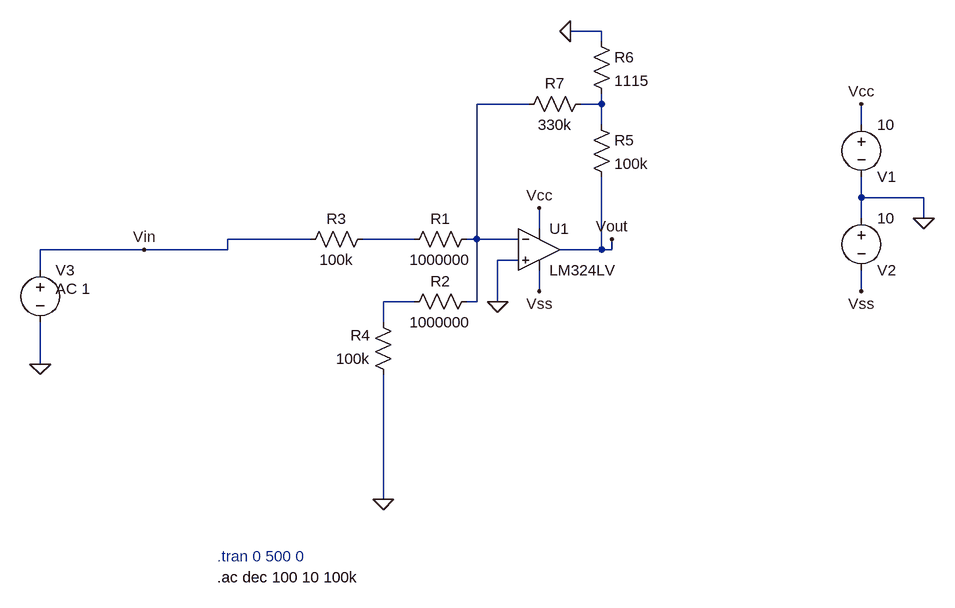
[diagram p0: schematic Sumador (1).asc]
Sumador (1).asc, the LTspice schematic file:
Version 4.1
SHEET 1 888 696
WIRE 304 -160 256 -160
WIRE 304 -144 304 -160
WIRE 192 -48 112 -48
WIRE 304 -48 304 -64
WIRE 304 -48 272 -48
WIRE 304 -16 304 -48
WIRE 704 -16 704 -48
WIRE 704 96 704 64
WIRE 800 96 704 96
WIRE 704 128 704 96
WIRE 800 128 800 96
WIRE 208 144 208 112
WIRE -144 160 -272 160
WIRE 16 160 -64 160
WIRE 112 160 112 -48
WIRE 112 160 96 160
WIRE 176 160 112 160
WIRE -400 176 -560 176
WIRE -272 176 -272 160
WIRE -272 176 -400 176
WIRE 304 176 304 64
WIRE 304 176 240 176
WIRE 320 176 320 160
WIRE 320 176 304 176
WIRE 176 192 144 192
WIRE -560 208 -560 176
WIRE 208 240 208 208
WIRE 704 240 704 208
WIRE 16 256 -32 256
WIRE 112 256 112 160
WIRE 112 256 96 256
WIRE 144 256 144 192
WIRE -32 288 -32 256
WIRE -560 352 -560 288
WIRE -32 560 -32 368
FLAG 144 256 0
FLAG -560 352 0
FLAG -32 560 0
FLAG 800 128 0
FLAG 208 112 Vcc
FLAG 704 -48 Vcc
FLAG 208 240 Vss
FLAG 704 240 Vss
FLAG -400 176 Vin
FLAG 320 160 Vout
FLAG 256 -160 0
SYMBOL res 112 144 R90
WINDOW 0 0 56 VBottom 2
WINDOW 3 32 56 VTop 2
SYMATTR InstName R1
SYMATTR Value 1000000
SYMBOL res 112 240 R90
WINDOW 0 0 56 VBottom 2
WINDOW 3 32 56 VTop 2
SYMATTR InstName R2
SYMATTR Value 1000000
SYMBOL res -48 144 R90
WINDOW 0 0 56 VBottom 2
WINDOW 3 32 56 VTop 2
SYMATTR InstName R3
SYMATTR Value 100k
SYMBOL res -16 384 R180
WINDOW 0 36 76 Left 2
WINDOW 3 36 40 Left 2
SYMATTR InstName R4
SYMATTR Value 100k
SYMBOL voltage 704 -32 R0
WINDOW 0 24 96 Left 2
WINDOW 3 24 16 Left 2
WINDOW 123 0 0 Left 0
WINDOW 39 0 0 Left 0
SYMATTR InstName V1
SYMATTR Value 10
SYMBOL voltage 704 112 R0
WINDOW 0 24 96 Left 2
WINDOW 3 24 16 Left 2
WINDOW 123 0 0 Left 0
WINDOW 39 0 0 Left 0
SYMATTR InstName V2
SYMATTR Value 10
SYMBOL ZZZ\\OpAmp\\LM324LV 208 112 R0
SYMATTR InstName U1
SYMBOL res 288 -32 R0
SYMATTR InstName R5
SYMATTR Value 100k
SYMBOL res 288 -160 R0
SYMATTR InstName R6
SYMATTR Value 1115
SYMBOL res 288 -64 R90
WINDOW 0 0 56 VBottom 2
WINDOW 3 32 56 VTop 2
SYMATTR InstName R7
SYMATTR Value 330k
SYMBOL voltage -560 192 R0
WINDOW 123 24 44 Left 2
WINDOW 39 0 0 Left 0
SYMATTR InstName V3
SYMATTR Value ""
SYMATTR Value2 AC 1
TEXT -288 648 Left 2 ;.tran 0 500 0
TEXT -288 680 Left 2 !.ac dec 100 10 100k

The netlist it stands for:
* Sumador (1).asc
R1 N001 N003 1000000
R2 N001 N004 1000000
R3 N003 Vin 100k
R4 0 N004 100k
V1 Vcc 0 10
V2 0 Vss 10
* U1: LM324LV (symbol ZZZ\OpAmp\LM324LV not available, pins judged from their places): In+=0 In-=N001 V+=Vcc V-=Vss OUT=Vout
R5 N002 Vout 100k
R6 0 N002 1115
R7 N002 N001 330k
V3 Vin 0 AC 1
* .tran 0 500 0
.ac dec 100 10 100k
.backanno
.end